# Altium schematic sheet callisto_schematics_analog.SchDoc: Callisto Module Analog
size A3; Author: Tomash Ghz; CompanyName: GHz Labs; DrawnBy: Tomash Ghz; Engineer: Tomash Ghz; Organization: GHz Labs; Address1: Tomash Ghz; Address2: Berlin 2019; Revision: 1.0; SheetNumber: 2; SheetTotal: 2; DocumentName: Callisto Module Analog; ProjectName: Callisto
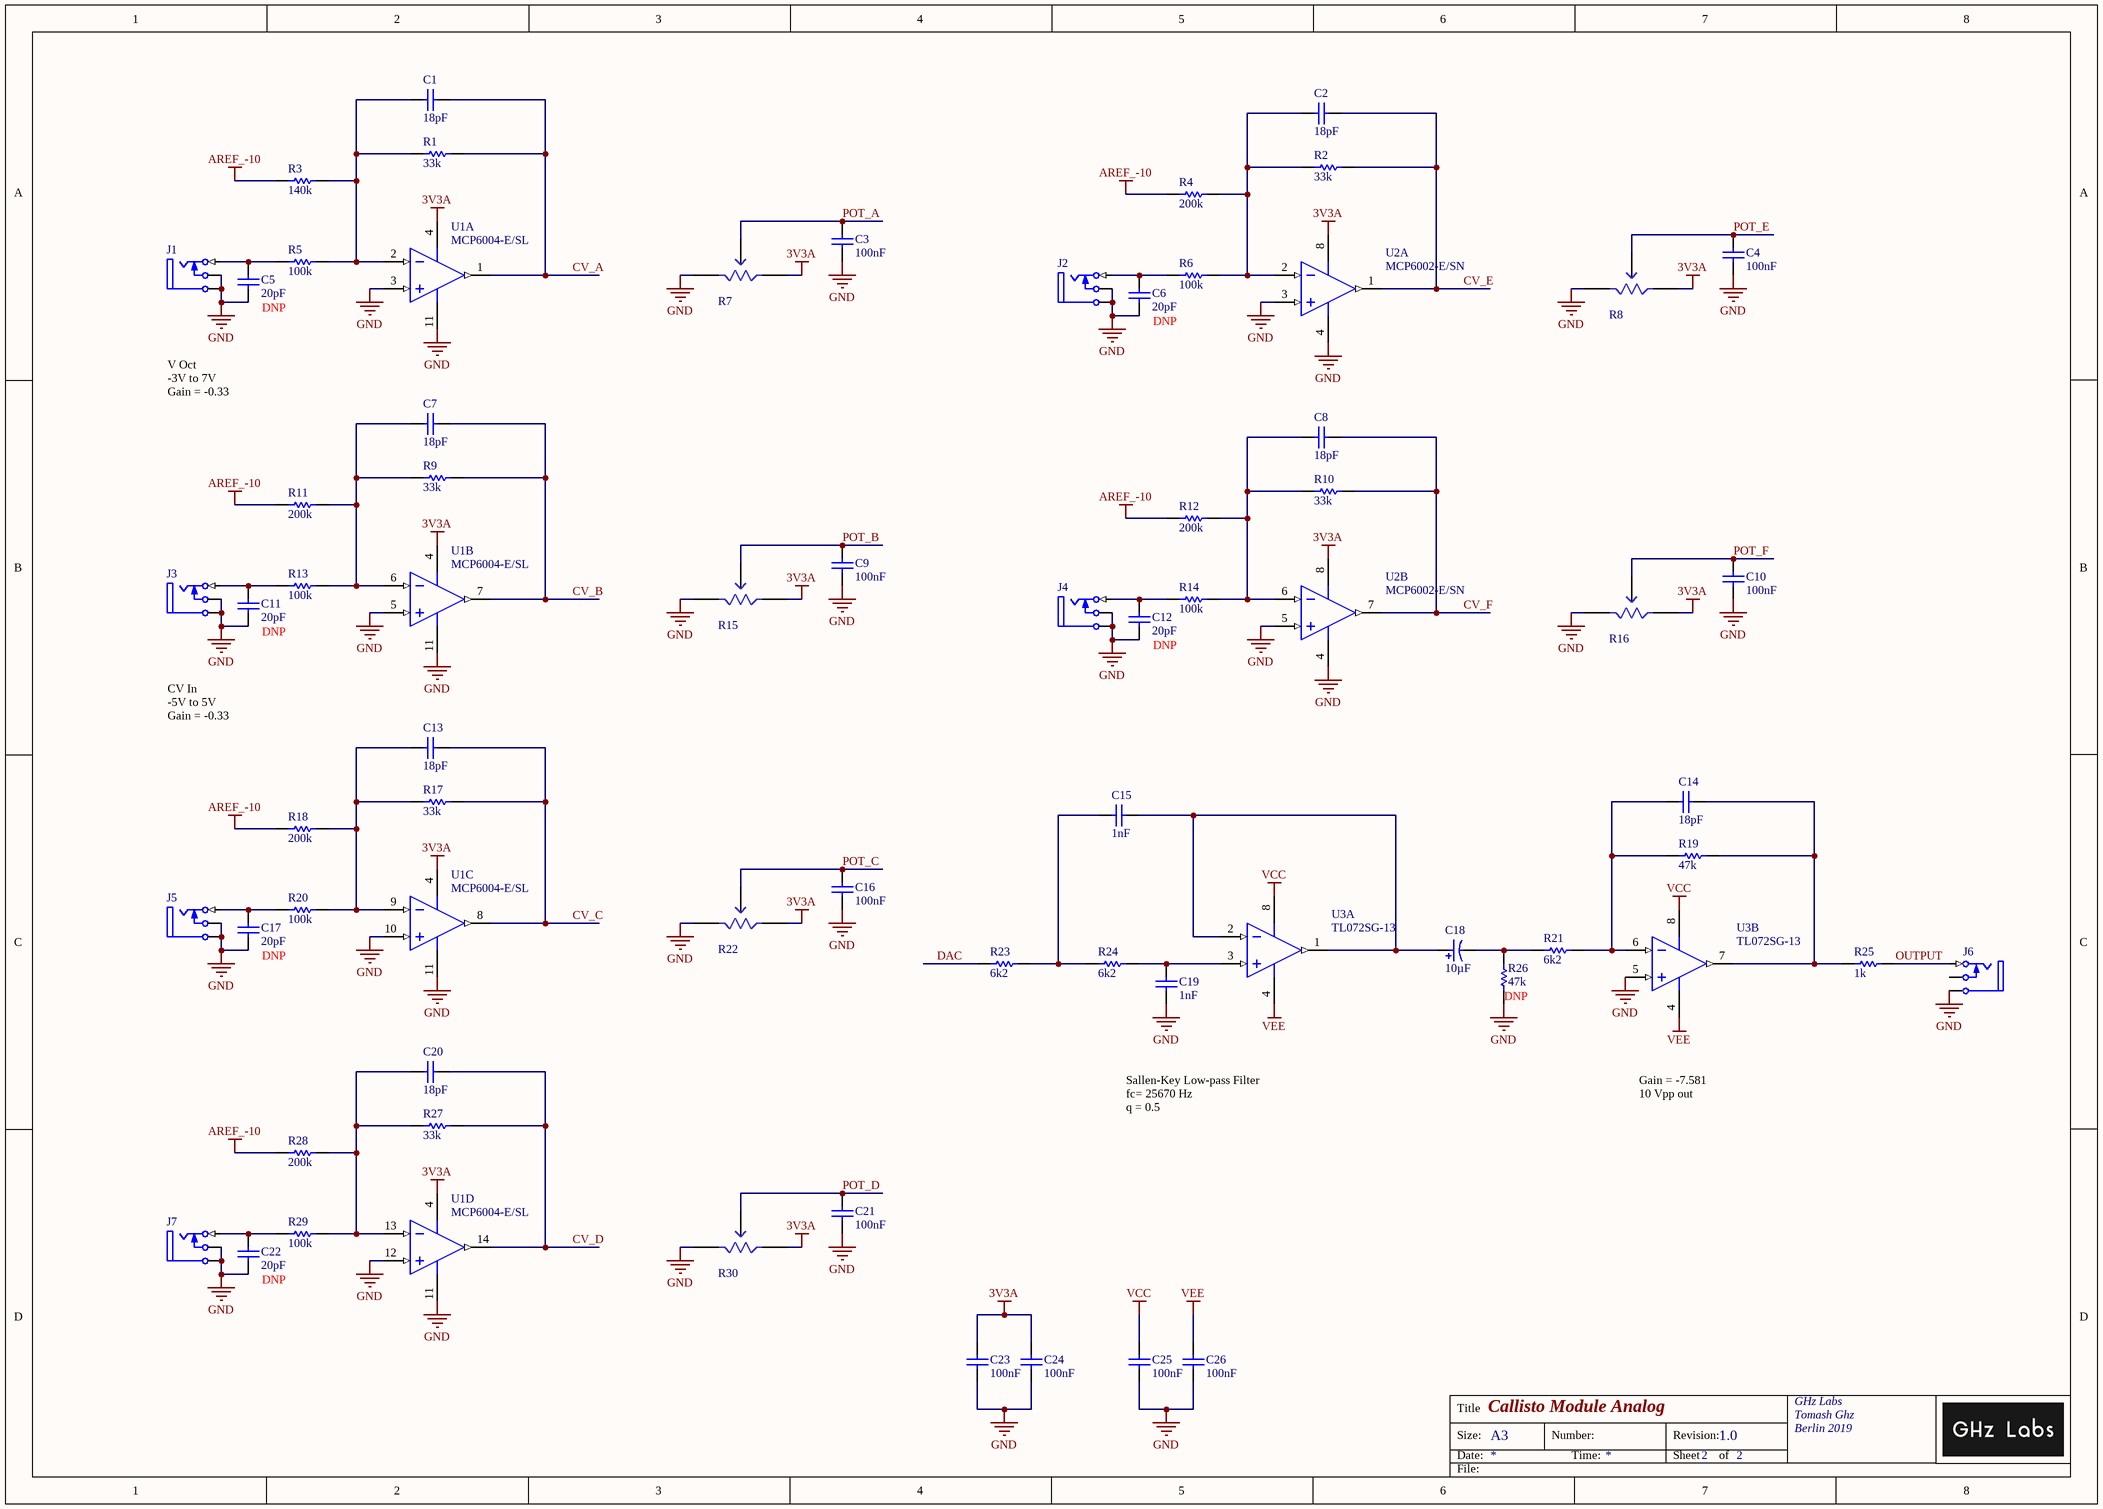
[diagram p0: callisto_schematics_analog.SchDoc]

## Parts
C1  18pF  [CAPA_0805]
C2  18pF  [CAPA_0805]
C3  100nF  [CAPA_0805]
C4  100nF  [CAPA_0805]
C5  20pF  [CAPA_0805]
C6  20pF  [CAPA_0805]
C7  18pF  [CAPA_0805]
C8  18pF  [CAPA_0805]
C9  100nF  [CAPA_0805]
C10  100nF  [CAPA_0805]
C11  20pF  [CAPA_0805]
C12  20pF  [CAPA_0805]
C13  18pF  [CAPA_0805]
C14  18pF  [CAPA_0805]
C15  1nF  [CAPA_0805]
C16  100nF  [CAPA_0805]
C17  20pF  [CAPA_0805]
C18  Capacitance: 10µF  [PNSC-FK-V-B_V]  (hidden comment: 10uF Electrolytic Capacitor)
C19  1nF  [CAPA_0805]
C20  18pF  [CAPA_0805]
C21  100nF  [CAPA_0805]
C22  20pF  [CAPA_0805]
C23  100nF  [CAPA_0805]
C24  100nF  [CAPA_0805]
C25  100nF  [CAPA_0805]
C26  100nF  [CAPA_0805]
J1  Phonejack2 TN  [Thonkiconn]  (value not drawn)
J2  Phonejack2 TN  [Thonkiconn]  (value not drawn)
J3  Phonejack2 TN  [Thonkiconn]  (value not drawn)
J4  Phonejack2 TN  [Thonkiconn]  (value not drawn)
J5  Phonejack2 TN  [Thonkiconn]  (value not drawn)
J6  Phonejack2 TN  [Thonkiconn]  (value not drawn)
J7  Phonejack2 TN  [Thonkiconn]  (value not drawn)
R1  33k  [RES_0805]
R2  33k  [RES_0805]
R3  140k  [RES_0805]
R4  200k  [RES_0805]
R5  100k  [RES_0805]
R6  100k  [RES_0805]
R7  Thumb Potentiometer  [POT-Thumb]  (value not drawn)
R8  Thumb Potentiometer  [POT-Thumb]  (value not drawn)
R9  33k  [RES_0805]
R10  33k  [RES_0805]
R11  200k  [RES_0805]
R12  200k  [RES_0805]
R13  100k  [RES_0805]
R14  100k  [RES_0805]
R15  Thumb Potentiometer  [POT-Thumb]  (value not drawn)
R16  Potentiometer  [POT-ALPHA]  (value not drawn)
R17  33k  [RES_0805]
R18  200k  [RES_0805]
R19  47k  [RES_0805]
R20  100k  [RES_0805]
R21  6k2  [RES_0805]
R22  Potentiometer  [POT-ALPHA]  (value not drawn)
R23  6k2  [RES_0805]
R24  6k2  [RES_0805]
R25  1k  [RES_0805]
R26  47k  [RES_0805]
R27  33k  [RES_0805]
R28  200k  [RES_0805]
R29  100k  [RES_0805]
R30  Potentiometer  [POT-ALPHA]  (value not drawn)
U1  MCP6004-E/SL  [SOIC-SL14_M]  (parts A,B,C,D of 4)
U2  MCP6002-E/SN  [SOIC-SN8_M]  (parts A,B of 2)
U3  TL072SG-13  [D0008A_M]  (parts A,B of 2)

## Nets
3V3A: C23.1 C24.1 R7.3 R8.3 R15.3 R16.3 R22.3 R30.3 U1.4(VDD) U2.8(VDD)
AREF_-10: R3.2 R4.2 R11.2 R12.2 R18.2 R28.2
GND: C3.2 C4.2 C5.1 C6.1 C9.2 C10.2 C11.1 C12.1 C16.2 C17.1 C19.1 C21.2 C22.1 C23.2 C24.2 C25.2 C26.2 J1.2(TN) J1.5(S) J2.2(TN) J2.5(S) J3.2(TN) J3.5(S) J4.2(TN) J4.5(S) J5.2(TN) J5.5(S) J6.5(S) J7.2(TN) J7.5(S) R7.1 R8.1 R15.1 R16.1 R22.1 R26.2 R30.1 U1.3(VINA+) U1.5(VINB+) U1.10(VINC+) U1.11(VSS) U1.12(VIND+) U2.3(VINA+) U2.4(VSS) U2.5(VINB+) U3.5(IN2+)
VCC: C25.1 U3.8(VCC+)
VEE: C26.1 U3.4(VCC-)
CV_A: C1.2 R1.1 U1.1(VOUTA)
CV_B: C7.2 R9.1 U1.7(VOUTB)
CV_C: C13.2 R17.1 U1.8(VOUTC)
CV_D: C20.2 R27.1 U1.14(VOUTD)
CV_E: C2.2 R2.1 U2.1(VOUTA)
CV_F: C8.2 R10.1 U2.7(VOUTB)
DAC: R23.2
OUTPUT: J6.1(T) R25.1
POT_A: C3.1 R7.2
POT_B: C9.1 R15.2
POT_C: C16.1 R22.2
POT_D: C21.1 R30.2
POT_E: C4.1 R8.2
POT_F: C10.1 R16.2
NetC1_1: C1.1 R1.2 R3.1 R5.1 U1.2(VINA-)
NetC2_1: C2.1 R2.2 R4.1 R6.1 U2.2(VINA-)
NetC5_2: C5.2 J1.1(T) R5.2
NetC6_2: C6.2 J2.1(T) R6.2
NetC7_1: C7.1 R9.2 R11.1 R13.1 U1.6(VINB-)
NetC8_1: C8.1 R10.2 R12.1 R14.1 U2.6(VINB-)
NetC11_2: C11.2 J3.1(T) R13.2
NetC12_2: C12.2 J4.1(T) R14.2
NetC13_1: C13.1 R17.2 R18.1 R20.1 U1.9(VINC-)
NetC14_1: C14.1 R19.2 R21.1 U3.6(IN2-)
NetC14_2: C14.2 R19.1 R25.2 U3.7(OUT2)
NetC15_1: C15.1 R23.1 R24.2
NetC15_2: C15.2 C18.1 U3.1(OUT1) U3.2(IN1-)
NetC17_2: C17.2 J5.1(T) R20.2
NetC18_2: C18.2 R21.2 R26.1
NetC19_2: C19.2 R24.1 U3.3(IN1+)
NetC20_1: C20.1 R27.2 R28.1 R29.1 U1.13(VIND-)
NetC22_2: C22.2 J7.1(T) R29.2

Not connected (* = marked no-connect by the designer): J6 2(TN)

## Notes on the sheet
- (near C5) DNP
- (near C6) DNP
- V Oct
  -3V to 7V
  Gain = -0.33
- (near C11) DNP
- (near C12) DNP
- CV In
  -5V to 5V
  Gain = -0.33
- (near C17) DNP
- (near R26) DNP
- Sallen-Key Low-pass Filter
  fc= 25670 Hz
  q = 0.5
- Gain = -7.581
  10 Vpp out
- (near C22) DNP
- Title
- Size:
- Date:
- A3
- Number:
- Time:
- Revision:
- Sheet
- of
- File:

## Library data of the parts
C1 C2 C7 C8 C13 C14 C20 = Cap: Capacitor; PartNumber: C0805C180J5GAC7210; Manufacturer: KEMET; Published: 8-Jun-2000; LatestRevisionDate: 17-Jul-2002; LatestRevisionNote: Re-released for DXP Platform.; PackageReference: RAD-0.3; Publisher: Altium Limited; PackageDescription: Radial Cap, Thru-Hole; 2 Leads; 0.3 in Pin Spacing; Value: 18pF
C3 C4 C9 C10 C16 C21 C23-C26 = Cap: Capacitor; Manufacturer: KEMET; PartNumber: C0805C104K4RAC; Published: 8-Jun-2000; LatestRevisionDate: 17-Jul-2002; LatestRevisionNote: Re-released for DXP Platform.; PackageReference: RAD-0.3; Publisher: Altium Limited; PackageDescription: Radial Cap, Thru-Hole; 2 Leads; 0.3 in Pin Spacing; Value: 100nF
C5 C6 C11 C12 C17 C22 = Cap: Capacitor; Published: 8-Jun-2000; LatestRevisionDate: 17-Jul-2002; LatestRevisionNote: Re-released for DXP Platform.; PackageReference: RAD-0.3; Publisher: Altium Limited; PackageDescription: Radial Cap, Thru-Hole; 2 Leads; 0.3 in Pin Spacing; Value: 20pF
C15 C19 = Cap: Capacitor; PartNumber: C0805C102K5GAC; Manufacturer: KEMET; Published: 8-Jun-2000; LatestRevisionDate: 17-Jul-2002; LatestRevisionNote: Re-released for DXP Platform.; PackageReference: RAD-0.3; Publisher: Altium Limited; PackageDescription: Radial Cap, Thru-Hole; 2 Leads; 0.3 in Pin Spacing; Value: 1nF
C18 = CMP-2000-06211-1: Aluminum Electrolytic Capacitor, 10 uF, +/- 20%, 35 V, 2-Pin SMD (Size Code B), -55 to 105 degC, RoHS, Tape and Reel; Manufacturer: Panasonic; PartNumber: EEE-FK1E100R; Impedance: 1.35O; Rated Voltage: 35V; Lifetime@Temperature: 2000Hrs@105°C; Ripple Current: 90mA; Type: Can; Manufacturer URL: http://www.panasonic.com/; Package Reference: FK-V-B; Operating Temp Range: -55to+105°C; Series: FK; Datasheet URL: http://industrial.panasonic.com/cdbs/www-data/pdf/RDE0000/ABA0000C1181.pdf; Mounting Technology: SurfaceMount; Package URL: http://industrial.panasonic.com/cdbs/www-data/pdf/RDE0000/DME0000COL48.pdf; Package Description: 2-Pin Electrolytic Aluminum Capacitor, Body 4.3 x 4.3 mm; Datasheet Version: 03/2016; Case Size/Dimension: Ø4x5.8mm; Operating Temp-Max: 105°C; Value: 10uF
J1-J7 = Phonejack2 TN: Jack Socket; Part: ACJM-MV35-2S; Manufacturer: Thonk; PartNumber: PJ398SM; Mouser: http://www.mouser.de/ProductDetail/Amphenol/ACJM-MV35-2S/?qs=%2fha2pyFaduh8uNgKuHZ7oEtHXwcSE0WAH4R1pjDPuhAHZsUXTeJRNg%3d%3d; Datasheet: http://www.amphenolaudio.com/wp-content/uploads/2015/07/55010544-001-rev-2.pdf; Thonk: https://www.thonk.co.uk/shop/3-5mm-jacks/
R1 R2 R9 R10 R17 R27 = Resistor: 33k 0805; PartNumber: RR1220P-333-D; Manufacturer: Susumu; Value: 33k; Mouser: http://www.mouser.de/ProductDetail/Susumu/RR1220P-105-D/?qs=sGAEpiMZZMu61qfTUdNhG%2fDhcyQpRg8MxiYDTLm9lx4%3d
R3 = Resistor: 140k 0805; PartNumber: RR1220P-1403-D-M; Manufacturer: Susumu; Value: 140k; Mouser: http://www.mouser.de/ProductDetail/Susumu/RR1220P-105-D/?qs=sGAEpiMZZMu61qfTUdNhG%2fDhcyQpRg8MxiYDTLm9lx4%3d
R4 R11 R12 R18 R28 = Resistor: 200k 0805; PartNumber: RR1220P-204-D; Manufacturer: Susumu; Value: 200k; Mouser: http://www.mouser.de/ProductDetail/Susumu/RR1220P-105-D/?qs=sGAEpiMZZMu61qfTUdNhG%2fDhcyQpRg8MxiYDTLm9lx4%3d
R5 R6 R13 R14 R20 R29 = Resistor: 100k 0805; PartNumber: RR1220P-104-D; Manufacturer: Susumu; Value: 100k; Mouser: http://www.mouser.de/ProductDetail/Susumu/RR1220P-105-D/?qs=sGAEpiMZZMu61qfTUdNhG%2fDhcyQpRg8MxiYDTLm9lx4%3d
R7 R8 R15 = Potentiometer: PartNumber: PTV09A-4020U-B104; Manufacturer: Bourns; Value: 100k Linear; Mouser: http://www.mouser.de/Search/ProductDetail.aspx?R=PTV09A-4020U-B104virtualkey65210000virtualkey652-PTV09A4020U-B104
R16 R22 R30 = Potentiometer: PartNumber: P0915N-FC15BR100K; Manufacturer: TT Electronics; Value: 100k Linear; Mouser: http://www.mouser.de/Search/ProductDetail.aspx?R=PTV09A-4020U-B104virtualkey65210000virtualkey652-PTV09A4020U-B104
R19 R26 = Resistor: 47k 0805; PartNumber: RT0805FRE0747KL; Manufacturer: Yageo; Value: 47k; Mouser: http://www.mouser.de/ProductDetail/Susumu/RR1220P-105-D/?qs=sGAEpiMZZMu61qfTUdNhG%2fDhcyQpRg8MxiYDTLm9lx4%3d
R21 R23 R24 = Resistor: 6k2 0805; PartNumber: RT0805FRE076K2L; Manufacturer: Yageo; Value: 6k2; Mouser: http://www.mouser.de/ProductDetail/Susumu/RR1220P-105-D/?qs=sGAEpiMZZMu61qfTUdNhG%2fDhcyQpRg8MxiYDTLm9lx4%3d
R25 = Resistor: 1k 0805; PartNumber: RR1220P-102-D; Manufacturer: Susumu; Value: 1k; Mouser: http://www.mouser.de/ProductDetail/Susumu/RR1220P-105-D/?qs=sGAEpiMZZMu61qfTUdNhG%2fDhcyQpRg8MxiYDTLm9lx4%3d
U1 = MCP6004-E/SL: 1 MHz, Low-Power Operational Amplifier, 14-Pin SOIC, Extended Temperature; PartNumber: MCP6004T-E/SL; Manufacturer: Microchip Technology; Published: 29-Jan-2009; LatestRevisionDate: 02-Dec-2009; LatestRevisionNote: Updated to datasheet revision J, Nov-2009; DatasheetVersion: revJ, Nov-2009; PackageVersion: revBB, Aug-2009; PackageReference: SOIC-SL14; Publisher: Altium Limited; PackageDescription: 14-Lead Plastic Small Outline (SL) - Narrow, 3.90mm Body [SOIC]; Supplier 1: Digi-Key; Supplier Part Number 1: MCP6004-E/SL-ND; Supplier 2: Farnell; Supplier Part Number 2: 1332122; Code_JEDEC: MS-012-AB; Code_IPC: SOIC127P600-14; ComponentLink1Description: Datasheet; ComponentLink1URL: http://ww1.microchip.com/downloads/en/DeviceDoc/21733j.pdf; ComponentLink2Description: Packaging Specification; ComponentLink2URL: http://www.microchip.com/stellent/groups/techpub_sg/documents/packagingspec/en012702.pdf; ComponentLink3Description: Microchip.com Home; ComponentLink3URL: http://www.microchip.com/; Mouser: http://www.mouser.de/ProductDetail/Microchip-Technology/MCP6004T-E-SL/?qs=sGAEpiMZZMtCHixnSjNA6N5WMYiF%252b1miedbE5%2f40CfM%3d
U2 = CMP-0187-00368-2: 1 MHz, Low-Power Operational Amplifier, 8-Pin SOIC, Extended Temperature; Manufacturer: Microchip Technology; ComponentLink1URL: http://www.microchip.com/; ComponentLink2URL: http://ww1.microchip.com/downloads/en/DeviceDoc/21733j.pdf; ComponentLink3URL: http://www.microchip.com/stellent/groups/techpub_sg/documents/packagingspec/en012702.pdf; Code_JEDEC: MS-012; PackageVersion: revBB, Aug-2009; ComponentLink2Description: Datasheet; PackageDescription: 8-Lead Plastic Small Outline (SN) - Narrow, 3.90mm Body [SOIC]; PackageReference: SOIC-SN8; ComponentLink1Description: Manufacturer URL; RevisionNote: URLs added.; Code_IPC: SOIC127P600-8; ComponentLink3Description: Package Specification; DatasheetVersion: revJ, Nov-2009; PartNumber: MCP6002-E/SN
U3 = CMP-0015-00092-2: Low-Noise JFET-Input Operational Amplifier, 7 to 36 V, 0 to 70 degC, 8-pin SOIC (D8), Green (RoHS & no Sb/Br); Manufacturer: Diodes Incorporated; Iq per channel(Max)(mA): 2.5; Total Supply Voltage(Max)(+5V is 5, +/-5V is 10): 36; Total Supply Voltage(Min)(+5V is 5, +/-5V is 10): 7; GBW(Typ)(MHz): 3; Sub Family: General Purpose Amplifier, High Supply Voltage Amplifier (>=30V); Number of Channels: 2; CMRR(Min)(dB): 75; Vn at 1kHz(Typ)(nV/rtHz): 18; Vio (25C)(Max)(mV): 6; Rating: Catalog; Slew Rate(Typ)(V/us): 13; IIB(Max)(pA): 200; PartNumber: TL072SG-13; ComponentLink3Description: Package Specification; PackageDescription: 8-Pin Plastic Small Outline, Body 4.9 x 3.9 mm, Pitch 1.27 mm; ComponentLink1Description: Manufacturer URL; PackageVersion: 4040047-3/M, 06/2011; ComponentLink1URL: http://www.ti.com/; Code_JEDEC: MS-012; Mounting Technology: Surface Mount; ComponentLink3URL: http://www.ti.com/litv/pdf/msoi002j; ComponentLink2Description: Datasheet; Offset Drift(Typ)(uV/C): 18; PackageReference: D0008A; DatasheetVersion: SLOS080J; ComponentLink2URL: http://www.ti.com/lit/ds/symlink/tl072a.pdf; Eco-Plan: Green (RoHS & no Sb/Br)